# Altium project MicroMouseMainPCD_Rev1.PrjPcb
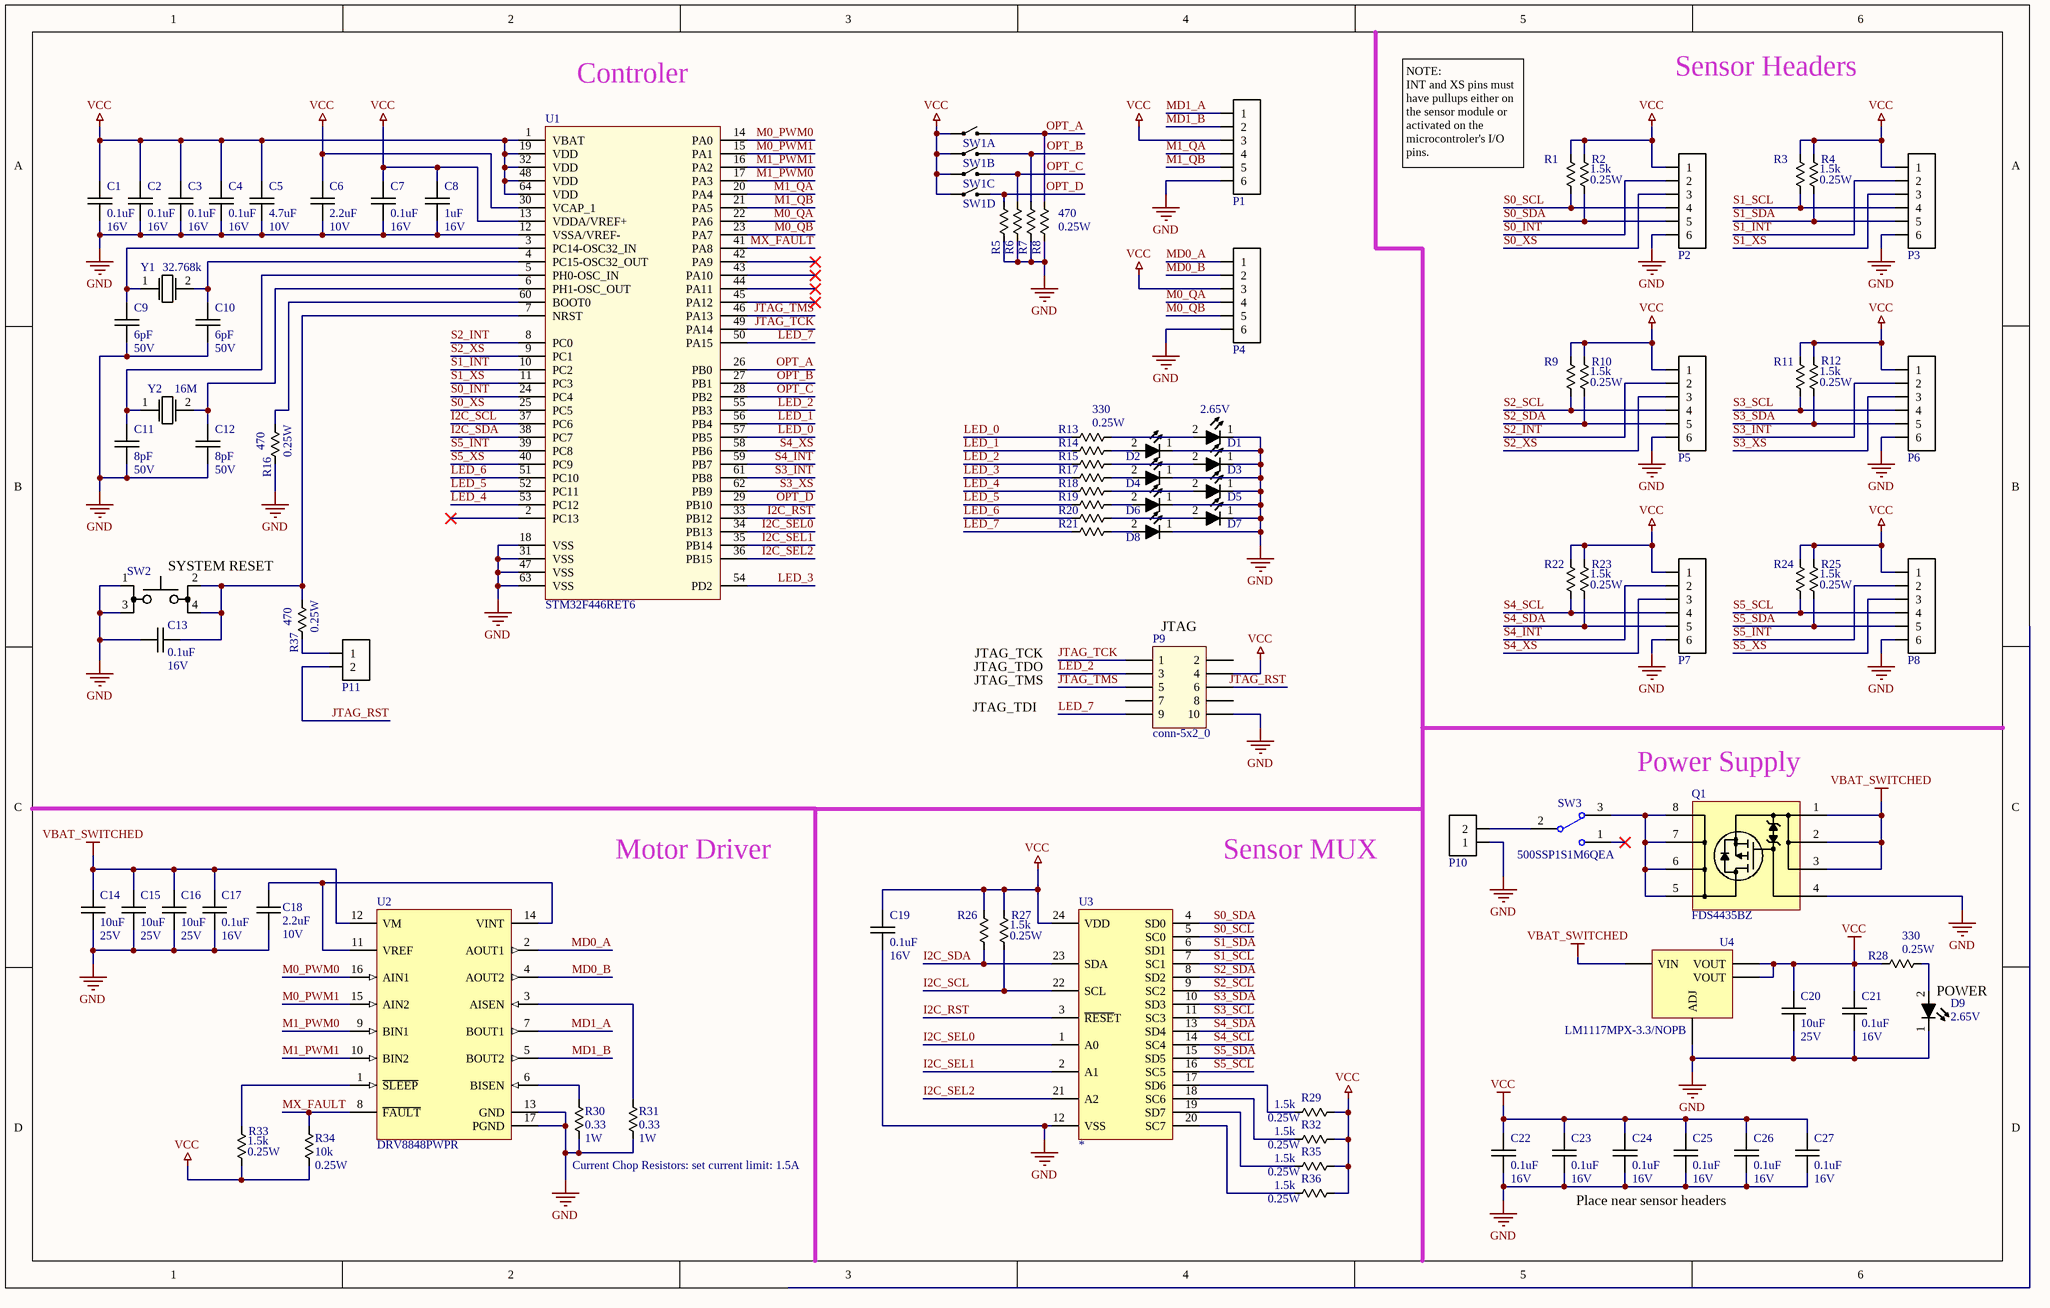
[diagram p0: Logic.SchDoc]
2 sheets, 94 parts. Net scope: global (net labels, ports and power ports of the same name join across sheets).
Board file: Logic.PcbDoc
Sheets:
  Logic.SchDoc
  SensorModule.SchDoc

## Sheet Logic.SchDoc
size B

### Parts
C1  Capacitance: 0.1uF  Voltage Rating: 16V  [chip_0603]  (hidden comment: cap_single_np)
C2  Capacitance: 0.1uF  Voltage Rating: 16V  [chip_0603]  (hidden comment: cap_single_np)
C3  Capacitance: 0.1uF  Voltage Rating: 16V  [chip_0603]  (hidden comment: cap_single_np)
C4  Capacitance: 0.1uF  Voltage Rating: 16V  [chip_0603]  (hidden comment: cap_single_np)
C5  Capacitance: 4.7uF  Voltage Rating: 10V  [chip_0805]  (hidden comment: cap_single_np)
C6  Capacitance: 2.2uF  Voltage Rating: 10V  [chip_0603]  (hidden comment: cap_single_np)
C7  Capacitance: 0.1uF  Voltage Rating: 16V  [chip_0603]  (hidden comment: cap_single_np)
C8  Capacitance: 1uF  Voltage Rating: 16V  [chip_0805]  (hidden comment: cap_single_np)
C9  Capacitance: 6pF  Voltage Rating: 50V  [chip_0603]  (hidden comment: cap_single_np)
C10  Capacitance: 6pF  Voltage Rating: 50V  [chip_0603]  (hidden comment: cap_single_np)
C11  Capacitance: 8pF  Voltage Rating: 50V  [chip_0603]  (hidden comment: cap_single_np)
C12  Capacitance: 8pF  Voltage Rating: 50V  [chip_0603]  (hidden comment: cap_single_np)
C13  Capacitance: 0.1uF  Voltage Rating: 16V  [chip_0603]  (hidden comment: cap_single_np)
C14  Capacitance: 10uF  Voltage Rating: 25V  [chip_1206]  (hidden comment: cap_single_np)
C15  Capacitance: 10uF  Voltage Rating: 25V  [chip_1206]  (hidden comment: cap_single_np)
C16  Capacitance: 10uF  Voltage Rating: 25V  [chip_1206]  (hidden comment: cap_single_np)
C17  Capacitance: 0.1uF  Voltage Rating: 16V  [chip_0603]  (hidden comment: cap_single_np)
C18  Capacitance: 2.2uF  Voltage Rating: 10V  [chip_0603]  (hidden comment: cap_single_np)
C19  Capacitance: 0.1uF  Voltage Rating: 16V  [chip_0603]  (hidden comment: cap_single_np)
C20  Capacitance: 10uF  Voltage Rating: 25V  [chip_1206]  (hidden comment: cap_single_np)
C21  Capacitance: 0.1uF  Voltage Rating: 16V  [chip_0603]  (hidden comment: cap_single_np)
C22  Capacitance: 0.1uF  Voltage Rating: 16V  [chip_0603]  (hidden comment: cap_single_np)
C23  Capacitance: 0.1uF  Voltage Rating: 16V  [chip_0603]  (hidden comment: cap_single_np)
C24  Capacitance: 0.1uF  Voltage Rating: 16V  [chip_0603]  (hidden comment: cap_single_np)
C25  Capacitance: 0.1uF  Voltage Rating: 16V  [chip_0603]  (hidden comment: cap_single_np)
C26  Capacitance: 0.1uF  Voltage Rating: 16V  [chip_0603]  (hidden comment: cap_single_np)
C27  Capacitance: 0.1uF  Voltage Rating: 16V  [chip_0603]  (hidden comment: cap_single_np)
D1  Forward Voltage: 2.65V  [chip_0603]  (hidden comment: diode_4)
D2  diode_4  [chip_0603]  (value not drawn)
D3  diode_4  [chip_0603]  (value not drawn)
D4  diode_4  [chip_0603]  (value not drawn)
D5  diode_4  [chip_0603]  (value not drawn)
D6  diode_4  [chip_0603]  (value not drawn)
D7  diode_4  [chip_0603]  (value not drawn)
D8  diode_4  [chip_0603]  (value not drawn)
D9  Forward Voltage: 2.65V  [chip_0603]  (hidden comment: diode_4)
P1  conn-6x1_0  [JST_PHR_6_0]  (value not drawn)
P2  conn-6x1_0  [HDDR_6X1_0]  (value not drawn)
P3  conn-6x1_0  [HDDR_6X1_0]  (value not drawn)
P4  conn-6x1_0  [JST_PHR_6_0]  (value not drawn)
P5  conn-6x1_0  [HDDR_6X1_0]  (value not drawn)
P6  conn-6x1_0  [HDDR_6X1_0]  (value not drawn)
P7  conn-6x1_0  [HDDR_6X1_0]  (value not drawn)
P8  conn-6x1_0  [HDDR_6X1_0]  (value not drawn)
P9  conn-5x2_0  [CNC_TECH_3020-10-0100-XX]
P10  conn-2x1_0  [PHOENIX_MKDS_5.08MM_2x1]  (value not drawn)
P11  conn-2x1_0  [hddr_2x1_0]  (value not drawn)
Q1  Manufacturer PN: FDS4435BZ  [SO-8]  (hidden comment: p-mosfet-SSSGDDDD)
R1  res_single  [chip_0603]  (value not drawn)
R2  Resistance: 1.5k  Power Rating: 0.25W  [chip_0603]  (hidden comment: res_single)
R3  res_single  [chip_0603]  (value not drawn)
R4  Resistance: 1.5k  Power Rating: 0.25W  [chip_0603]  (hidden comment: res_single)
R5  res_single  [chip_0603]  (value not drawn)
R6  res_single  [chip_0603]  (value not drawn)
R7  res_single  [chip_0603]  (value not drawn)
R8  Resistance: 470  Power Rating: 0.25W  [chip_0603]  (hidden comment: res_single)
R9  res_single  [chip_0603]  (value not drawn)
R10  Resistance: 1.5k  Power Rating: 0.25W  [chip_0603]  (hidden comment: res_single)
R11  res_single  [chip_0603]  (value not drawn)
R12  Resistance: 1.5k  Power Rating: 0.25W  [chip_0603]  (hidden comment: res_single)
R13  Resistance: 330  Power Rating: 0.25W  [chip_0603]  (hidden comment: res_single)
R14  res_single  [chip_0603]  (value not drawn)
R15  res_single  [chip_0603]  (value not drawn)
R16  Resistance: 470  Power Rating: 0.25W  [chip_0603]  (hidden comment: res_single)
R17  res_single  [chip_0603]  (value not drawn)
R18  res_single  [chip_0603]  (value not drawn)
R19  res_single  [chip_0603]  (value not drawn)
R20  res_single  [chip_0603]  (value not drawn)
R21  res_single  [chip_0603]  (value not drawn)
R22  res_single  [chip_0603]  (value not drawn)
R23  Resistance: 1.5k  Power Rating: 0.25W  [chip_0603]  (hidden comment: res_single)
R24  res_single  [chip_0603]  (value not drawn)
R25  Resistance: 1.5k  Power Rating: 0.25W  [chip_0603]  (hidden comment: res_single)
R26  res_single  [chip_0603]  (value not drawn)
R27  Resistance: 1.5k  Power Rating: 0.25W  [chip_0603]  (hidden comment: res_single)
R28  Resistance: 330  Power Rating: 0.25W  [chip_0603]  (hidden comment: res_single)
R29  Resistance: 1.5k  Power Rating: 0.25W  [chip_0603]  (hidden comment: res_single)
R30  Resistance: 0.33  Power Rating: 1W  [chip_2512]  (hidden comment: res_single)
R31  Resistance: 0.33  Power Rating: 1W  [chip_2512]  (hidden comment: res_single)
R32  Resistance: 1.5k  Power Rating: 0.25W  [chip_0603]  (hidden comment: res_single)
R33  Resistance: 1.5k  Power Rating: 0.25W  [chip_0603]  (hidden comment: res_single)
R34  Resistance: 10k  Power Rating: 0.25W  [chip_0603]  (hidden comment: res_single)
R35  Resistance: 1.5k  Power Rating: 0.25W  [chip_0603]  (hidden comment: res_single)
R36  Resistance: 1.5k  Power Rating: 0.25W  [chip_0603]  (hidden comment: res_single)
R37  Resistance: 470  Power Rating: 0.25W  [chip_0603]  (hidden comment: res_single)
SW1  DIP_SW_4  [A6S-4104-H]  (value not drawn)  (parts A,B,C,D of 4)
SW2  SW_1P1T_0  [KMR6]  (value not drawn)
SW3  Manufacturer PN: 500SSP1S1M6QEA  [E-Switch_500SSPyS1M6yEA]  (hidden comment: SW-SPDT)
U1  Manufacturer PN: STM32F446RET6  [LQFP64_0]  (hidden comment: STM32F446_64_0)
U2  Manufacturer PN: DRV8848PWPR  [HTSSOP-16_0]  (hidden comment: DRV8848)
U3  TCA9548A  [tssop-24_0]  (value not drawn)
U4  Manufacturer PN: LM1117MPX-3.3/NOPB  [sot-223-4]  (hidden comment: LM1117)
Y1  Frequency: 32.768k  [ABS25_OSC]  (hidden comment: osc_xtal_2p_0)
Y2  Frequency: 16M  [smd2-0]  (hidden comment: osc_xtal_2p_0)

### Nets
GND: C1.2 C2.2 C3.2 C4.2 C5.2 C6.2 C7.2 C8.2 C9.2 C10.2 C11.2 C12.2 C13.2 C14.2 C15.2 C16.2 C17.2 C18.2 C19.2 C20.2 C21.2 C22.2 C23.2 C24.2 C25.2 C26.2 C27.2 D1.1 D2.1 D3.1 D4.1 D5.1 D6.1 D7.1 D8.1 D9.1 P1.6 P2.6 P3.6 P4.6 P5.6 P6.6 P7.6 P8.6 P9.10 P10.1 Q1.4(G) R5.2 R6.2 R7.2 R8.2 R16.2 R30.2 R31.2 SW2.1 SW2.3 U1.12(VSSA/VREF-) U1.18(VSS) U1.31(VSS) U1.47(VSS) U1.63(VSS) U2.13(GND) U2.17(PGND) U3.12(VSS) U4.1(ADJ)
VBAT_SWITCHED: C14.1 C15.1 C16.1 C17.1 Q1.1(S) Q1.2(S) Q1.3(S) U2.12(VM) U4.3(VIN)
VCC: C1.1 C2.1 C3.1 C4.1 C5.1 C6.1 C7.1 C8.1 C19.1 C20.1 C21.1 C22.1 C23.1 C24.1 C25.1 C26.1 C27.1 P1.3 P2.1 P3.1 P4.3 P5.1 P6.1 P7.1 P8.1 P9.4 R1.1 R2.1 R3.1 R4.1 R9.1 R10.1 R11.1 R12.1 R22.1 R23.1 R24.1 R25.1 R26.1 R27.1 R28.1 R29.2 R32.2 R33.2 R34.2 R35.2 R36.2 SW1.1 SW1.2 SW1.3 SW1.4 U1.1(VBAT) U1.13(VDDA/VREF+) U1.19(VDD) U1.30(VCAP_1) U1.32(VDD) U1.48(VDD) U1.64(VDD) U3.24(VDD) U4.2(VOUT) U4.4(VOUT)
I2C_RST: U1.33(PB12) U3.3(~{RESE}T)
I2C_SCL: R27.2 U1.37(PC6) U3.22(SCL)
I2C_SDA: R26.2 U1.38(PC7) U3.23(SDA)
I2C_SEL0: U1.34(PB13) U3.1(A0)
I2C_SEL1: U1.35(PB14) U3.2(A1)
I2C_SEL2: U1.36(PB15) U3.21(A2)
JTAG_RST: P9.6 P11.2
JTAG_TCK: P9.1 U1.49(PA14)
JTAG_TMS: P9.5 U1.46(PA13)
LED_0: R13.1 U1.57(PB5)
LED_1: R14.1 U1.56(PB4)
LED_2: P9.3 R15.1 U1.55(PB3)
LED_3: R17.1 U1.54(PD2)
LED_4: R18.1 U1.53(PC12)
LED_5: R19.1 U1.52(PC11)
LED_6: R20.1 U1.51(PC10)
LED_7: P9.9 R21.1 U1.50(PA15)
M0_PWM0: U1.14(PA0) U2.16(AIN1)
M0_PWM1: U1.15(PA1) U2.15(AIN2)
M0_QA: P4.4 U1.22(PA6)
M0_QB: P4.5 U1.23(PA7)
M1_PWM0: U1.17(PA3) U2.9(BIN1)
M1_PWM1: U1.16(PA2) U2.10(BIN2)
M1_QA: P1.4 U1.20(PA4)
M1_QB: P1.5 U1.21(PA5)
MD0_A: P4.1 U2.2(AOUT1)
MD0_B: P4.2 U2.4(AOUT2)
MD1_A: P1.1 U2.7(BOUT1)
MD1_B: P1.2 U2.5(BOUT2)
MX_FAULT: R34.1 U1.41(PA8) U2.8(~{FAULT})
OPT_A: R8.1 SW1.8 U1.26(PB0)
OPT_B: R7.1 SW1.7 U1.27(PB1)
OPT_C: R6.1 SW1.6 U1.28(PB2)
OPT_D: R5.1 SW1.5 U1.29(PB10)
S0_INT: P2.2 U1.24(PC4)
S0_SCL: P2.4 R1.2 U3.5(SC0)
S0_SDA: P2.5 R2.2 U3.4(SD0)
S0_XS: P2.3 U1.25(PC5)
S1_INT: P3.2 U1.10(PC2)
S1_SCL: P3.4 R3.2 U3.7(SC1)
S1_SDA: P3.5 R4.2 U3.6(SD1)
S1_XS: P3.3 U1.11(PC3)
S2_INT: P5.2 U1.8(PC0)
S2_SCL: P5.4 R9.2 U3.9(SC2)
S2_SDA: P5.5 R10.2 U3.8(SD2)
S2_XS: P5.3 U1.9(PC1)
S3_INT: P6.2 U1.61(PB8)
S3_SCL: P6.4 R11.2 U3.11(SC3)
S3_SDA: P6.5 R12.2 U3.10(SD3)
S3_XS: P6.3 U1.62(PB9)
S4_INT: P7.2 U1.59(PB7)
S4_SCL: P7.4 R22.2 U3.14(SC4)
S4_SDA: P7.5 R23.2 U3.13(SD4)
S4_XS: P7.3 U1.58(PB6)
S5_INT: P8.2 U1.39(PC8)
S5_SCL: P8.4 R24.2 U3.16(SC5)
S5_SDA: P8.5 R25.2 U3.15(SD5)
S5_XS: P8.3 U1.40(PC9)
NetC9_1: C9.1 U1.3(PC14-OSC32_IN) Y1.1
NetC10_1: C10.1 U1.4(PC15-OSC32_OUT) Y1.2
NetC11_1: C11.1 U1.5(PH0-OSC_IN) Y2.1
NetC12_1: C12.1 U1.6(PH1-OSC_OUT) Y2.2
NetC13_1: C13.1 R37.1 SW2.2 SW2.4 U1.7(NRST)
NetC18_1: C18.1 U2.11(VREF) U2.14(VINT)
NetD1_2: D1.2 R13.2
NetD2_2: D2.2 R14.2
NetD3_2: D3.2 R15.2
NetD4_2: D4.2 R17.2
NetD5_2: D5.2 R18.2
NetD6_2: D6.2 R19.2
NetD7_2: D7.2 R20.2
NetD8_2: D8.2 R21.2
NetD9_2: D9.2 R28.2
NetP10_2: P10.2 SW3.2
NetP11_1: P11.1 R37.2
NetQ1_5: Q1.5(D) Q1.6(D) Q1.7(D) Q1.8(D) SW3.3
NetR16_1: R16.1 U1.60(BOOT0)
NetR29_1: R29.1 U3.17(SD6)
NetR30_1: R30.1 U2.6(BISEN)
NetR31_1: R31.1 U2.3(AISEN)
NetR32_1: R32.1 U3.18(SC6)
NetR33_1: R33.1 U2.1(~{SLEEP})
NetR35_1: R35.1 U3.19(SD7)
NetR36_1: R36.1 U3.20(SC7)

Not connected (* = marked no-connect by the designer): P9 2 7 8; SW3 1*; U1 2(PC13)* 42(PA9)* 43(PA10)* 44(PA11)* 45(PA12)*

### Notes on the sheet
- (near U1) Controler
- Sensor Headers
- NOTE:
  INT and XS pins must have pullups either on the sensor module or activated on the microcontroler's I/O pins.
- (near SW2) SYSTEM RESET
- (near P9) JTAG
- JTAG_TDI
- JTAG_TMS
- JTAG_TDO
- JTAG_TCK
- Power Supply
- Motor Driver
- Sensor MUX
- (near D9) POWER
- Current Chop Resistors: set current limit: 1.5A
- Place near sensor headers

### Library data of the parts
C1-C4 C7 C13 C17 C19 C21-C27 = CAP-00542: CAP, 0.1uF, ±10%, 16V, X7R, 0603; Manufacturer: Murata; Tolerance: ±10%; Part Number: CAP-00542; Type: X7R
C5 = CAP-00126: CAP, 4.7uF, 10%, 10V, X7R, 0805; Manufacturer: Murata; Manufacturer PN: GRM21BR71A475KA73K; Tolerance: 10%; Part Number: CAP-00126; Type: X7R
C6 C18 = CAP-00531: CAP, 2.2uF, ±10%, 10V, X7R, 0603; Manufacturer: Murata; Manufacturer PN: GRM188R71A225KE15J; Tolerance: ±10%; Part Number: CAP-00531; Type: X7R
C8 = CAP-00107: CAP, 1uF, 10%, 16V, X7R, 0805; Manufacturer: Murata; Manufacturer PN: GRM21BR71C105KA01L; Tolerance: 10%; Part Number: CAP-00107; Type: X7R
C9 C10 = CAP-00538: CAP, 6pF, ±10%, 50V, C0G, 0603; Tolerance: ±10%; Part Number: CAP-00538; Type: C0G
C11 C12 = CAP-00402: CAP, 8pF, ±0.1pF, 50V, C0G, 0603; Manufacturer: Murata; Manufacturer PN: GRM1885C1H8R0BA01D; Tolerance: ±0.1pF; Part Number: CAP-00402; Type: C0G
C14-C16 C20 = CAP-00539: CAP, 10uF, ±10%, 25V, X7R, 1206; Manufacturer: Samsung; Manufacturer PN: CL31B106KAHNNNE; Tolerance: ±10%; Part Number: CAP-00539; Type: X7R
D1 = DIO-00050: LED, Green, 0603, Low current, HELI2 Series; Manufacturer: Kingbright; Manufacturer PN: APT1608LZGCK; Reverse Breakdown Voltage: 5V; Current Rating: 30mA; Power Rating: 120mW; Type: LED; Part Number: DIO-00050; Cost: 0.58
D2-D8 = DIO-00050: LED, Green, 0603, Low current, HELI2 Series; Manufacturer: Kingbright; Manufacturer PN: APT1608LZGCK; Reverse Breakdown Voltage: 5V; Current Rating: 30mA; Forward Voltage: 2.65V; Power Rating: 120mW; Type: LED; Part Number: DIO-00050; Cost: 0.58
D9 = DIO-00049: LED, Blue, 0603, Low current, HELI2 Series; Manufacturer: Kingbright; Manufacturer PN: APT1608LVBC/D; Reverse Breakdown Voltage: 5V; Current Rating: 30mA; Power Rating: 120mW; Type: LED; Part Number: DIO-00049; Cost: 0.58
P1 P4 = CONN-00017: JST PHR 6x1; Positions per level: 6; Levels: 1; Part Number: CONN-00017; Type: Header; Manufacturer: JST
P2 P3 P5-P8 = CONN-00008: Header 6x1, 0.1"; Positions per level: 6; Levels: 1; Part Number: CONN-00008
P9 = CONN-00054: Header, 10-pin IDC, 2.54mm Pitch; Manufacturer: CNC Tech; Manufacturer PN: 3020-10-0100-00; Positions per level: 5; Levels: 2; Part Number: CONN-00054; Type: Header; Cost: 0.58
P10 = CONN-00014: Term Blk, 2 Pos, 0.2", 10A, 14-30 AWG, Rising Cage Clamp; Manufacturer: Phoenix Contact; Manufacturer PN: 1729128; Positions per level: 2; Levels: 1; Current: 10; Part Number: CONN-00014; Type: Terminal Block
P11 = CONN-00055: Header, 2x1, 0.1"; Manufacturer: Samtec; Manufacturer PN: TSW-102-07-F-S; Positions per level: 2; Levels: 1; Part Number: CONN-00055; Type: Header; Cost: 0.2
Q1 = XSTR-00033: XSTR PFET, 8.8A, 30V, 2.5W, SOIC-8; Manufacturer: ON Semi; Vgs/Vce: 2.1V; Max Voltage: 30V; Max Current: 8.8A; Part Number: XSTR-00033; Max Power: 2.5W; Type: PFET
R1 R3 R9 R11 R22 R24 R26 = RES-00284: RES SMD 1.5K OHM 1% 1/4W 0603; Manufacturer: Panasonic; Manufacturer PN: ERJ-PA3F1501V; Power Rating: 0.25W; Tolerance: 1%; Resistance: 1.5k; Part Number: RES-00284
R2 R4 R10 R12 R23 R25 R27 R29 R32 R33 R35 R36 = RES-00284: RES SMD 1.5K OHM 1% 1/4W 0603; Manufacturer: Panasonic; Manufacturer PN: ERJ-PA3F1501V; Tolerance: 1%; Part Number: RES-00284
R5-R7 = RES-00236: RES SMD 470 OHM 1% 1/4W 0603; Manufacturer: Panasonic; Manufacturer PN: ERJ-PA3F4700V; Resistance: 470; Power Rating: 0.25W; Tolerance: 1%; Part Number: RES-00236
R8 R16 R37 = RES-00236: RES SMD 470 OHM 1% 1/4W 0603; Manufacturer: Panasonic; Manufacturer PN: ERJ-PA3F4700V; Tolerance: 1%; Part Number: RES-00236
R13-R15 R17-R21 R28 = RES-00221: RES SMD 330 OHM 1% 1/4W 0603; Manufacturer: Panasonic; Manufacturer PN: ERJ-PA3F3300V; Tolerance: 1%; Part Number: RES-00221
R30 R31 = RES-00692: RES SMD 0.33 OHM 1% 1W 2512; Manufacturer: Panasonic; Manufacturer PN: ERJ-1TRQFR33U; Tolerance: 1%; Part Number: RES-00692; Cost: 0.64
R34 = RES-00306: RES SMD 10K OHM 1% 1/4W 0603; Manufacturer: Panasonic; Manufacturer PN: ERJ-PA3F1002V; Tolerance: 1%; Part Number: RES-00306; Cost: 0.144
SW1 = MISC-00026: DIP Switch, SMD, 25mA, 24V; Manufacturer: Omron; Manufacturer PN: A6S-4104-H; Part Number: MISC-00026; Cost: 1.51
SW2 = MISC-00024: Switch, SPST, Tactile, 32V 50mA; Manufacturer PN: KMR621NG LFS; Manufacturer: C&K; Part Number: MISC-00024; Cost: 0.33
SW3 = MISC-00033: Switch, SPDT, 120VAC/28VDC, 5A, Horizontal Slide Switch; Manufacturer: E-Switch; Current Rating: *A; ComponentLink1Description: Manufacturer Link; ComponentLink1URL: http://www.apem.com; Part Number: MISC-00033; Cost: 3.93
U1 = UCTRL-00002: STM32F4 Series, 32-bit ARM M4, 180MHz, LQFP64; Manufacturer: ST; Part Number: UCTRL-00002
U2 = MISC-00022: IC, Motor Driver, Quad Half-Bridge, 4-18V; Manufacturer: TI; Part Number: MISC-00022; Cost: 1.53
U3 = IFACE-00001: I2C 8-Channel Mux with Reset, TCA9548A; Manufacturer: TI; Manufacture PN: *; Part Number: IFACE-00001; Manufacturer PN: TCA9548A; Cost: 1.55
U4 = PWREG-00018: REG, Linear, Fixed 3V3, 800mA, SOT-223; Manufacturer: TI; Voltage Range In: 4.5 - 15V; Voltage Range Out: 3.3V; Part Number: PWREG-00018; Max Current: 800mA; Reg Type: Linear; Fixed/Adj: Fixed; Cost: 1.14
Y1 = OSC-00003: XTAL, 32.768kHz, 6pF, 20ppm; Manufacturer: Abracon; Manufacturer PN: ABS25-32.768KHZ-6-T; ESR: 50k; Stability: *ppm; Load Capacitance: 6pF; Tolerance: 20ppm; Part Number: OSC-00003
Y2 = OSC-00000: XTAL, 16MHz, 8pF, 50, 20ppm; Manufacturer: NDK; Manufacturer PN: NX5032GA-16MHZ-STD-CSK-4; ESR: 50; Stability: 30ppm; Load Capacitance: 8pF; Tolerance: 20ppm; Part Number: OSC-00000

## Sheet SensorModule.SchDoc
size A